# EAGLE design TuesdayR4 (EAGLE 7.7.0)
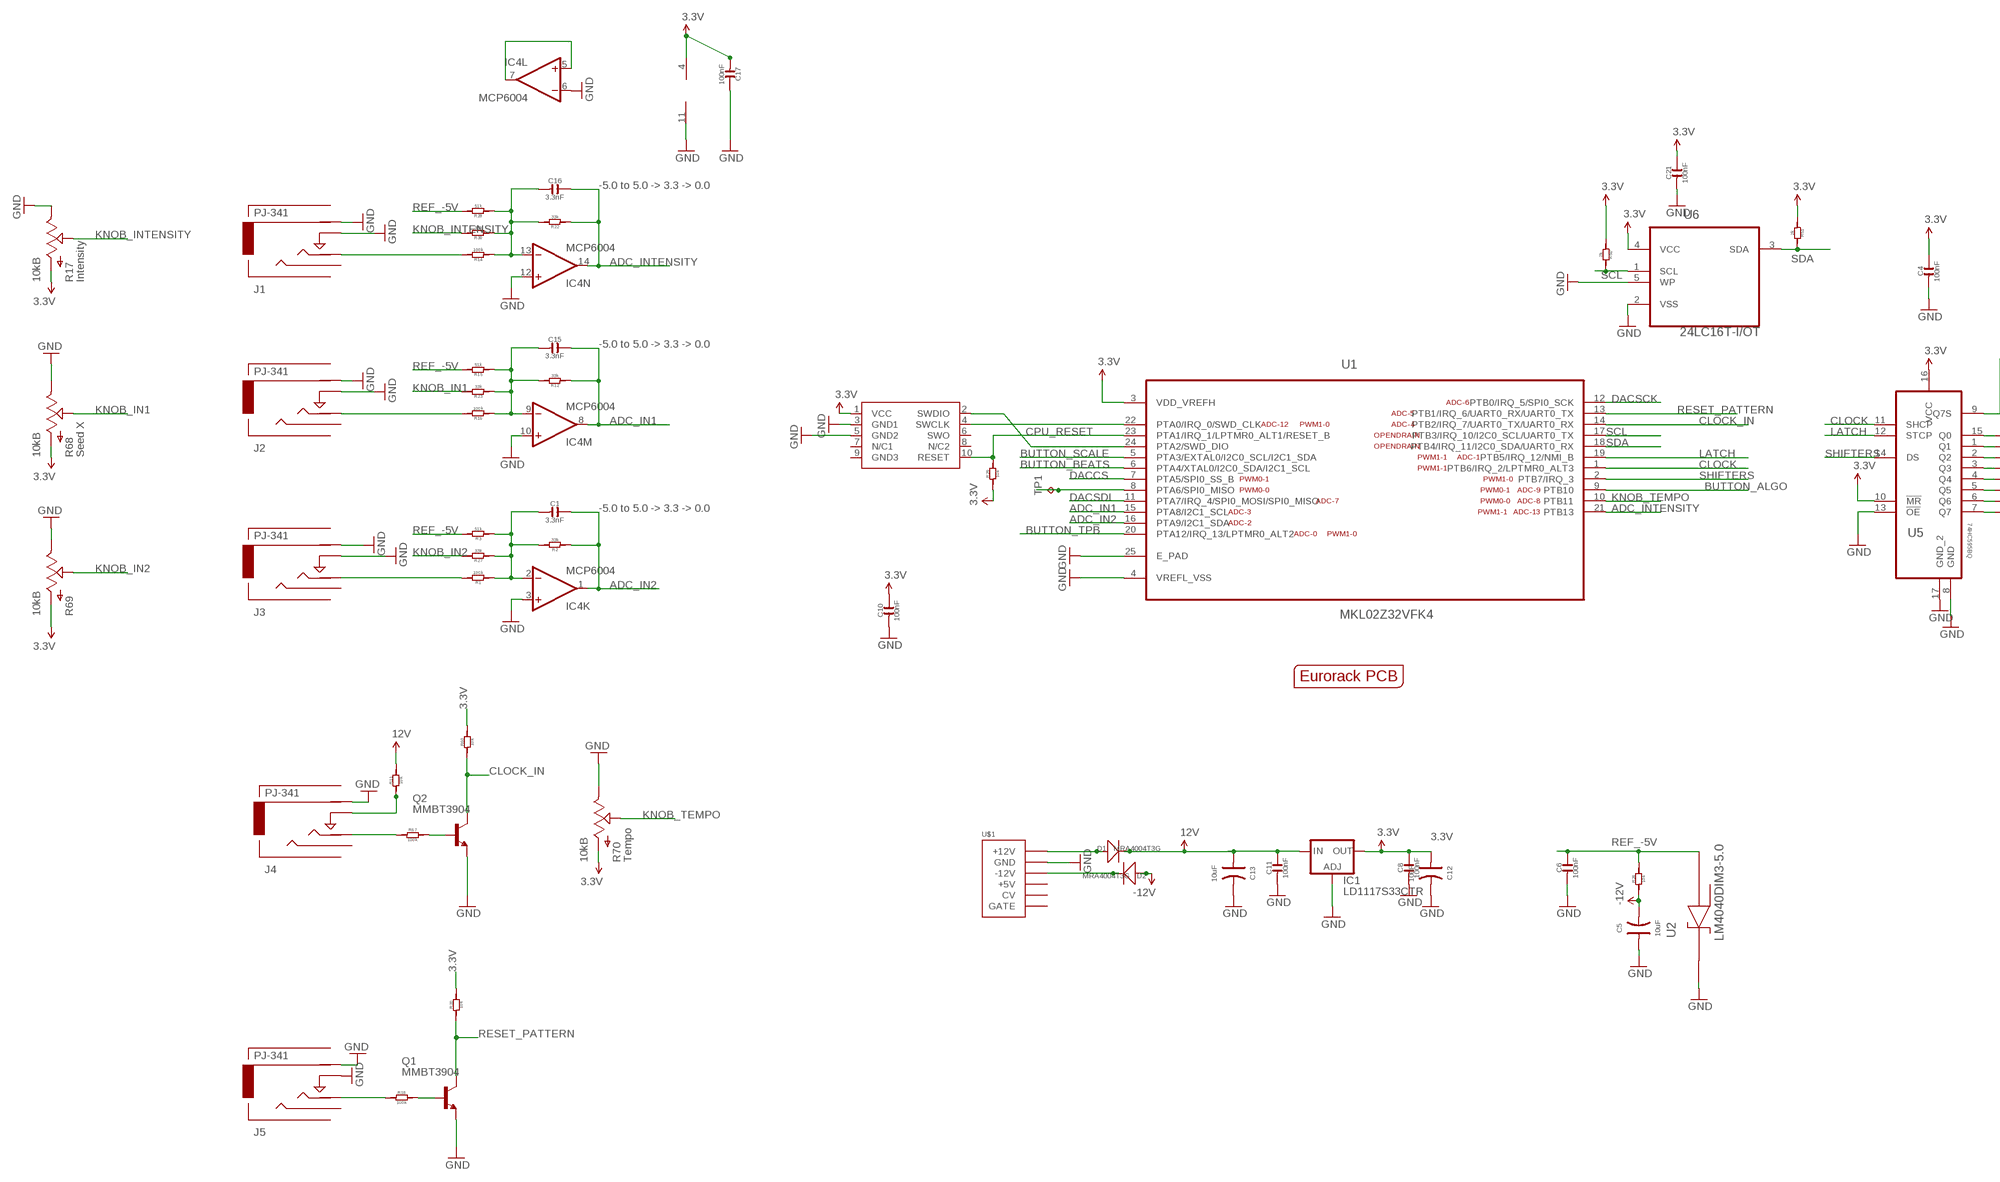
[diagram p0: schematic, sheet 1, part 1 of 2]
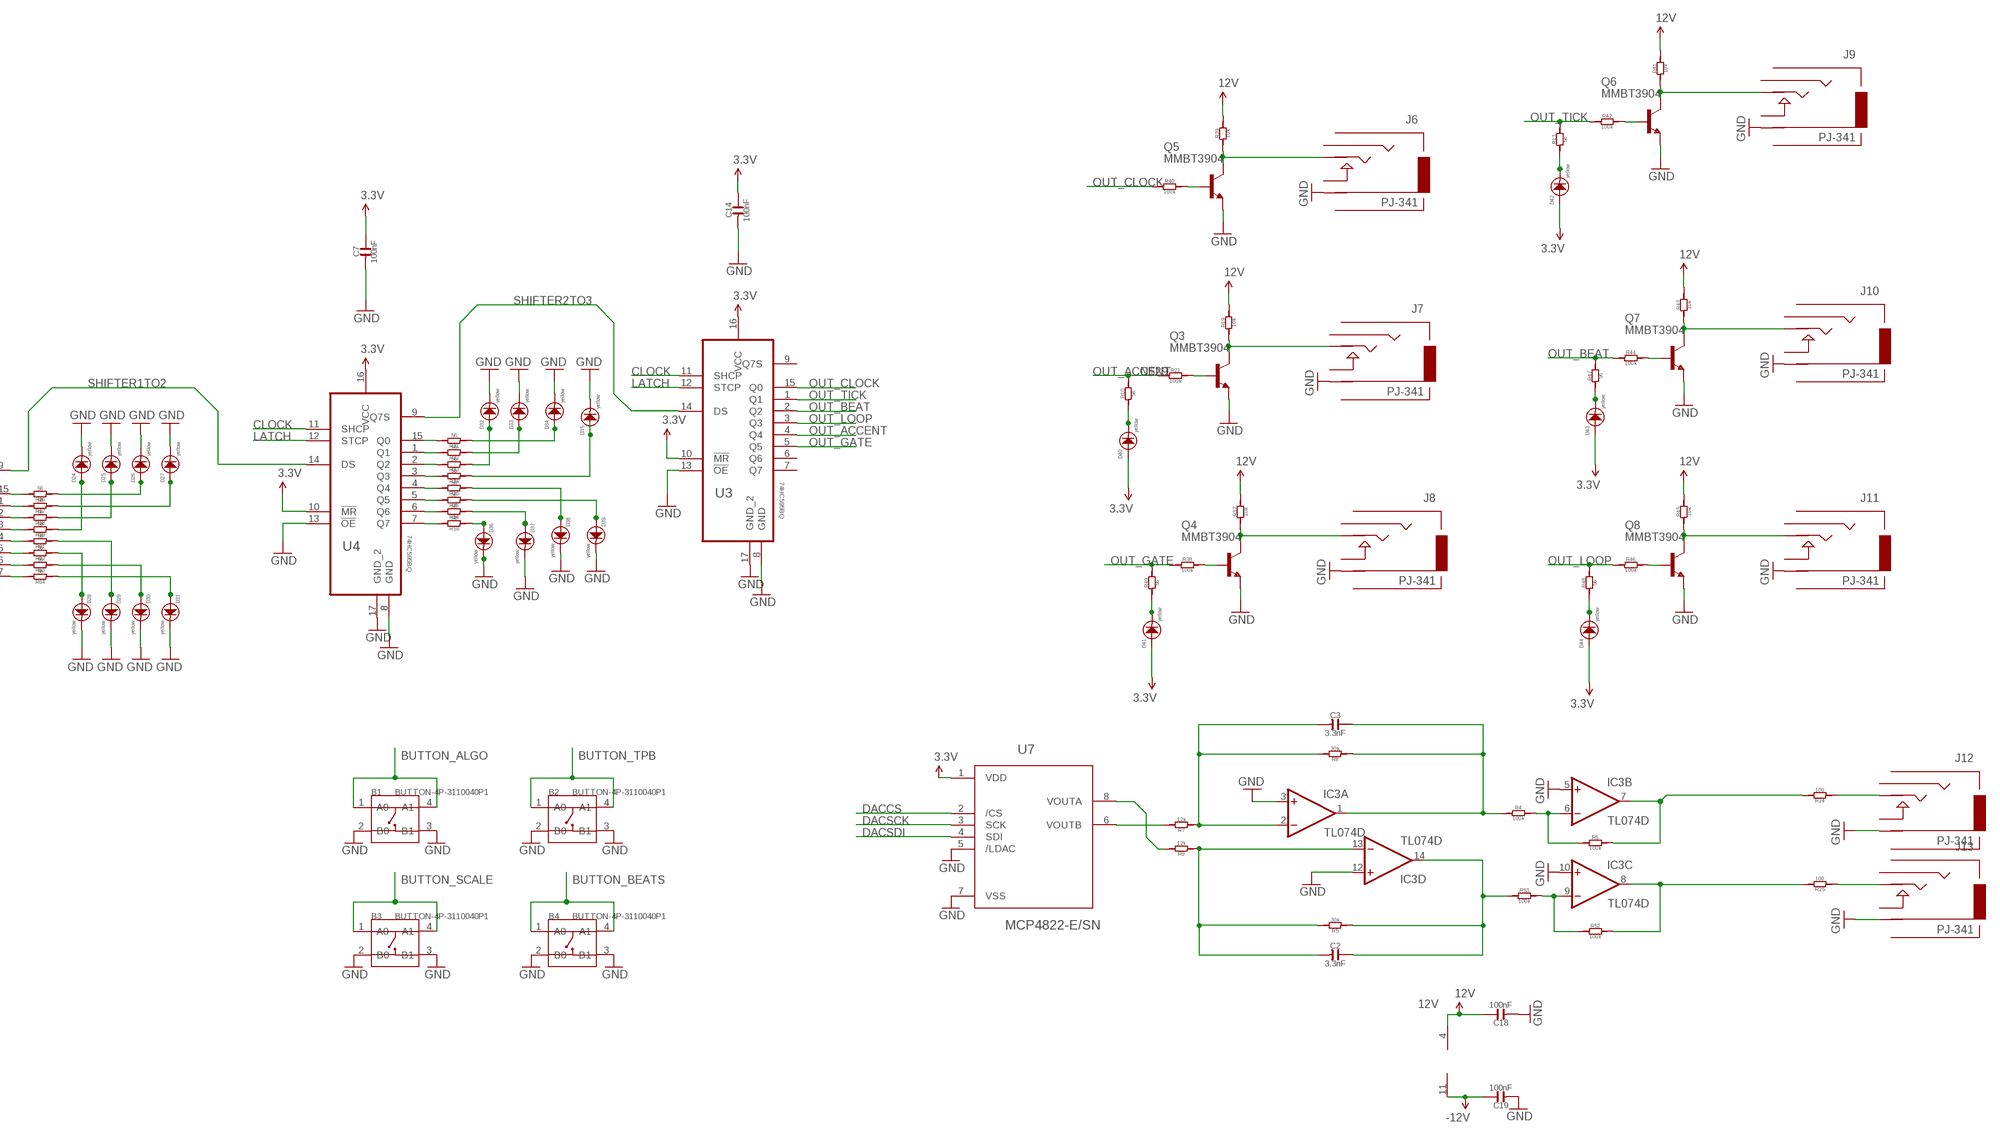
[diagram p1: schematic, sheet 1, part 2 of 2]

## Parts
B1  BUTTON-4P-3110040P1  [4P-6.0X6.0X5.0H]
B2  BUTTON-4P-3110040P1  [4P-6.0X6.0X5.0H]
B3  BUTTON-4P-3110040P1  [4P-6.0X6.0X5.0H]
B4  BUTTON-4P-3110040P1  [4P-6.0X6.0X5.0H]
C1  3.3nF  C-0603  [C0603]
C2  3.3nF  C-0603  [C0603]
C3  3.3nF  C-0603  [C0603]
C4  100nF  C-0603  [C0603]
C5  10uF  C-POLAR-A  [AVX-A]
C6  100nF  C-0603  [C0603]
C7  100nF  C-0603  [C0603]
C8  100nF  C-0603  [C0603]
C10  100nF  C-0603  [C0603]
C11  100nF  C-0603  [C0603]
C12  10uF  C-POLAR-A  [AVX-A]
C13  10uF  C-POLAR-A  [AVX-A]
C14  100nF  C-0603  [C0603]
C15  3.3nF  C-0603  [C0603]
C16  3.3nF  C-0603  [C0603]
C17  100nF  C-0603  [C0603]
C18  100nF  C-0603  [C0603]
C19  100nF  C-0603  [C0603]
C21  100nF  C-0603  [C0603]
D1  MRA4004T3G  D-SMA  [DO-214AC]
D2  MRA4004T3G  D-SMA  [DO-214AC]
D24  yellow  LED3MM  [3MMLED]
D25  yellow  LED3MM  [3MMLED]
D26  yellow  LED3MM  [3MMLED]
D27  yellow  LED3MM  [3MMLED]
D28  yellow  LED3MM  [3MMLED]
D29  yellow  LED3MM  [3MMLED]
D30  yellow  LED3MM  [3MMLED]
D31  yellow  LED3MM  [3MMLED]
D32  yellow  LED3MM  [3MMLED]
D33  yellow  LED3MM  [3MMLED]
D34  yellow  LED3MM  [3MMLED]
D35  yellow  LED3MM  [3MMLED]
D36  yellow  LED3MM  [3MMLED]
D37  yellow  LED3MM  [3MMLED]
D38  yellow  LED3MM  [3MMLED]
D39  yellow  LED3MM  [3MMLED]
D40  yellow  LED3MM  [3MMLED]
D41  yellow  LED3MM  [3MMLED]
D42  yellow  LED3MM  [3MMLED]
D43  yellow  LED3MM  [3MMLED]
D44  yellow  LED3MM  [3MMLED]
IC1  LD1117S33CTR  LD1117AS33TR  [SOT223]
IC3  TL074D  [SO14]
IC4  MCP6004  [SO14]
J1  PJ-341  AUDIO-JACKINPUT  [3.5MM-JACK-SWITCH-13MM-INPUT]
J2  PJ-341  AUDIO-JACKINPUT  [3.5MM-JACK-SWITCH-13MM-INPUT]
J3  PJ-341  AUDIO-JACKINPUT  [3.5MM-JACK-SWITCH-13MM-INPUT]
J4  PJ-341  AUDIO-JACKINPUT  [3.5MM-JACK-SWITCH-13MM-INPUT]
J5  PJ-341  AUDIO-JACKINPUT  [3.5MM-JACK-SWITCH-13MM-INPUT]
J6  PJ-341  AUDIO-JACKOUTPUT  [3.5MM-JACK-SWITCH-13MM-OUTPUT]
J7  PJ-341  AUDIO-JACKOUTPUT  [3.5MM-JACK-SWITCH-13MM-OUTPUT]
J8  PJ-341  AUDIO-JACKOUTPUT  [3.5MM-JACK-SWITCH-13MM-OUTPUT]
J9  PJ-341  AUDIO-JACKOUTPUT  [3.5MM-JACK-SWITCH-13MM-OUTPUT]
J10  PJ-341  AUDIO-JACKOUTPUT  [3.5MM-JACK-SWITCH-13MM-OUTPUT]
J11  PJ-341  AUDIO-JACKOUTPUT  [3.5MM-JACK-SWITCH-13MM-OUTPUT]
J12  PJ-341  AUDIO-JACKOUTPUT  [3.5MM-JACK-SWITCH-13MM-OUTPUT]
J13  PJ-341  AUDIO-JACKOUTPUT  [3.5MM-JACK-SWITCH-13MM-OUTPUT]
OUTLINE  EURORACK_PCB12HP  [EURORACK12HPPCB]
Q1  MMBT3904  MMBT3904LT1-NPN-SOT23-BEC  [SOT23-BEC]
Q2  MMBT3904  MMBT3904LT1-NPN-SOT23-BEC  [SOT23-BEC]
Q3  MMBT3904  MMBT3904LT1-NPN-SOT23-BEC  [SOT23-BEC]
Q4  MMBT3904  MMBT3904LT1-NPN-SOT23-BEC  [SOT23-BEC]
Q5  MMBT3904  MMBT3904LT1-NPN-SOT23-BEC  [SOT23-BEC]
Q6  MMBT3904  MMBT3904LT1-NPN-SOT23-BEC  [SOT23-BEC]
Q7  MMBT3904  MMBT3904LT1-NPN-SOT23-BEC  [SOT23-BEC]
Q8  MMBT3904  MMBT3904LT1-NPN-SOT23-BEC  [SOT23-BEC]
R1  100k  R-0603  [R0603]
R2  33k  R-0603  [R0603]
R3  51k  R-0603  [R0603]
R4  100k  R-0603  [R0603]
R5  30k  R-0603  [R0603]
R6  100k  R-0603  [R0603]
R7  12k  R-0603  [R0603]
R8  30k  R-0603  [R0603]
R9  12k  R-0603  [R0603]
R10  56  R-0603  [R0603]
R11  10k  R-0603  [R0603]
R12  33k  R-0603  [R0603]
R13  56  R-0603  [R0603]
R14  100k  R-0603  [R0603]
R15  51k  R-0603  [R0603]
R16  100k  R-0603  [R0603]
R17  10kB  POTZEPHPOT  [OG-POTS_ALPS_POT_VERTICAL]
R18  100k  R-0603  [R0603]
R19  10k  R-0603  [R0603]
R20  10k  R-0603  [R0603]
R21  100k  R-0603  [R0603]
R22  33k  R-0603  [R0603]
R23  33k  R-0603  [R0603]
R24  100  R-0603  [R0603]
R25  100  R-0603  [R0603]
R26  10k  R-0603  [R0603]
R27  33k  R-0603  [R0603]
R28  51k  R-0603  [R0603]
R29  10k  R-0603  [R0603]
R30  33k  R-0603  [R0603]
R31  56  R-0603  [R0603]
R32  56  R-0603  [R0603]
R33  56  R-0603  [R0603]
R34  56  R-0603  [R0603]
R35  56  R-0603  [R0603]
R36  56  R-0603  [R0603]
R37  10k  R-0603  [R0603]
R38  100k  R-0603  [R0603]
R39  10k  R-0603  [R0603]
R40  100k  R-0603  [R0603]
R41  10k  R-0603  [R0603]
R42  100k  R-0603  [R0603]
R43  10k  R-0603  [R0603]
R44  100k  R-0603  [R0603]
R45  10k  R-0603  [R0603]
R46  100k  R-0603  [R0603]
R47  56  R-0603  [R0603]
R48  56  R-0603  [R0603]
R49  56  R-0603  [R0603]
R50  2k  R-0603  [R0603]
R51  2k  R-0603  [R0603]
R52  100k  R-0603  [R0603]
R53  100k  R-0603  [R0603]
R54  56  R-0603  [R0603]
R55  56  R-0603  [R0603]
R56  56  R-0603  [R0603]
R57  56  R-0603  [R0603]
R58  56  R-0603  [R0603]
R59  56  R-0603  [R0603]
R60  10k  R-0603  [R0603]
R61  56  R-0603  [R0603]
R62  56  R-0603  [R0603]
R63  56  R-0603  [R0603]
R64  56  R-0603  [R0603]
R67  100k  R-0603  [R0603]
R68  10kB  POTZEPHPOT  [OG-POTS_ALPS_POT_VERTICAL]
R69  10kB  POTZEPHPOT  [OG-POTS_ALPS_POT_VERTICAL]
R70  10kB  POTZEPHPOT  [OG-POTS_ALPS_POT_VERTICAL]
SWD1  CORTEX_SWD  [M50-3600542]
TP1  TPB1,27  [B1,27]
U1  MKL02Z32VFK4  [QFN50P400X400X100-25N]
U2  LM4040DIM3-5.0  [SOT95P237X112-3N]
U3  74HC595BQ  [QFN50P250X350X100-17N]
U4  74HC595BQ  [QFN50P250X350X100-17N]
U5  74HC595BQ  [QFN50P250X350X100-17N]
U6  24LC16T-I/OT  24LC00T-I/OT  [SOT95P290X145-5N]
U7  MCP4822-E/SN  [SOIC8-N_MC]
U$1  POWERSMT  [2X08_SMT_HEADER]

## Nets
3.3V [mediumpower]: C4.2 C7.2 C8.2 C10.2 C12.+ C14.2 C17.1 C21.2 D40.+ D41.+ D42.+ D43.+ D44.+ IC1.2(OUT) IC1.4(OUT) IC4.4(O:V+) R17.P$3(A) R20.2 R29.1 R50.1 R51.1 R60.2 R68.P$3(A) R69.P$3(A) R70.P$3(A) SWD1.1(VCC) U1.3(VDD_VREFH) U3.10(!MR) U3.16(VCC) U4.10(!MR) U4.16(VCC) U5.10(!MR) U5.16(VCC) U6.4(VCC) U7.1(VDD)
12V [heavypower]: C11.2 C13.+ C18.2 D1.2(-) IC1.3(IN) IC3.4(P:V+) R11.2 R19.2 R37.2 R39.2 R41.2 R43.2 R45.2
-12V [heavypower]: C5.- C19.2 D2.1(+) IC3.11(P:V-) R26.1
ADC_IN1: C15.2 IC4.8(M:OUT) R12.1 U1.15(PTA8/I2C1_SCL)
ADC_IN2: C1.2 IC4.1(K:OUT) R2.1 U1.16(PTA9/I2C1_SDA)
ADC_INTENSITY: C16.2 IC4.14(N:OUT) R22.1 U1.21(PTB13)
BUTTON_ALGO: B1.1(A0) B1.4(A1) U1.9(PTB10)
BUTTON_BEATS: B4.1(A0) B4.4(A1) U1.6(PTA4/XTAL0/I2C0_SDA/I2C1_SCL)
BUTTON_SCALE: B3.1(A0) B3.4(A1) U1.5(PTA3/EXTAL0/I2C0_SCL/I2C1_SDA)
BUTTON_TPB: B2.1(A0) B2.4(A1) U1.20(PTA12/IRQ_13/LPTMR0_ALT2)
CLOCK: U1.1(PTB6/IRQ_2/LPTMR0_ALT3) U3.11(SHCP) U4.11(SHCP) U5.11(SHCP)
CLOCK_IN: Q2.C R60.1 U1.14(PTB2/IRQ_7/UART0_TX/UART0_RX)
CPU_RESET: R29.2 SWD1.10(RESET) U1.23(PTA1/IRQ_1/LPTMR0_ALT1/RESET_B)
D21: D43.- R47.1
DACCS: U1.7(PTA5/SPI0_SS_B) U7.2(/CS)
DACSCK: U1.12(PTB0/IRQ_5/SPI0_SCK) U7.3(SCK)
DACSDI: U1.11(PTA7/IRQ_4/SPI0_MOSI/SPI0_MISO) U7.4(SDI)
GND [groundplane]: B1.2(B0) B1.3(B1) B2.2(B0) B2.3(B1) B3.2(B0) B3.3(B1) B4.2(B0) B4.3(B1) C4.1 C5.+ C6.1 C7.1 C8.1 C10.1 C11.1 C12.- C13.- C14.1 C17.2 C18.1 C19.1 C21.1 D24.- D25.- D26.- D27.- D28.- D29.- D30.- D31.- D32.- D33.- D34.- D35.- D36.- D37.- D38.- D39.- IC1.1(ADJ) IC3.3(A:+IN) IC3.5(B:+IN) IC3.10(C:+IN) IC3.12(D:+IN) IC4.3(K:+IN) IC4.6(L:-IN) IC4.10(M:+IN) IC4.11(O:V-) IC4.12(N:+IN) J1.RING@3(RING) J1.SWITCH@3(SWITCH) J2.RING@3(RING) J2.SWITCH@3(SWITCH) J3.RING@3(RING) J3.SWITCH@3(SWITCH) J4.RING@3(RING) J5.RING@3(RING) J5.SWITCH@3(SWITCH) J6.RING@3(RING) J7.RING@3(RING) J8.RING@3(RING) J9.RING@3(RING) J10.RING@3(RING) J11.RING@3(RING) J12.RING@3(RING) J13.RING@3(RING) Q1.E Q2.E Q3.E Q4.E Q5.E Q6.E Q7.E Q8.E R17.P$1(E) R68.P$1(E) R69.P$1(E) R70.P$1(E) SWD1.3(GND1) SWD1.5(GND2) U1.4(VREFL_VSS) U1.25(E_PAD) U2.1(CATHODE) U3.8(GND) U3.13(!OE) U3.17(GND_2) U4.8(GND) U4.13(!OE) U4.17(GND_2) U5.8(GND) U5.13(!OE) U5.17(GND_2) U6.2(VSS) U6.5(WP) U7.5(/LDAC) U7.7(VSS) U$1.3(GND) U$1.4(GND) U$1.5(GND) U$1.6(GND) U$1.7(GND) U$1.8(GND)
KNOB_IN1: R23.2 R68.P$2(S)
KNOB_IN2: R27.2 R69.P$2(S)
KNOB_INTENSITY: R17.P$2(S) R30.2
KNOB_TEMPO: R70.P$2(S) U1.10(PTB11)
LATCH: U1.19(PTB5/IRQ_12/NMI_B) U3.12(STCP) U4.12(STCP) U5.12(STCP)
N$1: R32.2 U4.1(Q1)
N$2: IC3.6(B:-IN) R4.2 R6.1
N$3: J2.TIP@3(TIP) R16.2
N$4: C15.1 IC4.9(M:-IN) R12.2 R15.1 R16.1 R23.1
N$5: R9.2 U7.8(VOUTA)
N$6: J3.TIP@3(TIP) R1.2
N$7: R7.2 U7.6(VOUTB)
N$8: C1.1 IC4.2(K:-IN) R1.1 R2.2 R3.1 R27.1
N$9: C2.1 IC3.13(D:-IN) R5.2 R9.1
N$10: C3.1 IC3.2(A:-IN) R7.1 R8.2
N$12: D42.- R13.1
N$13 [heavypower]: D1.1(+) U$1.9(+12V) U$1.10(+12V)
N$14: IC3.7(B:OUT) R6.2 R24.2
N$15: Q1.B R18.2
N$16: J5.TIP@3(TIP) R18.1
N$17: IC3.9(C:-IN) R52.1 R53.2
N$18: C3.2 IC3.1(A:OUT) R4.1 R8.1
N$19: R33.2 U4.2(Q2)
N$20: J13.TIP@3(TIP) R25.1
N$21: J12.TIP@3(TIP) R24.1
N$23: D40.- R10.1
N$24: C2.2 IC3.14(D:OUT) R5.1 R53.1
N$25: Q3.B R21.2
N$26: R34.2 U4.3(Q3)
N$27: R35.2 U4.4(Q4)
N$28: D28.+ R62.1
N$29: J7.TIP@3(TIP) Q3.C R19.1
N$30: R36.2 U4.5(Q5)
N$31: R54.2 U4.6(Q6)
N$32: D29.+ R61.1
N$33: J1.TIP@3(TIP) R14.2
N$34: C16.1 IC4.13(N:-IN) R14.1 R22.2 R28.1 R30.1
N$35: R55.2 U4.7(Q7)
N$36: R31.2 U4.15(Q0)
N$37: R56.2 U5.15(Q0)
N$38: R57.2 U5.1(Q1)
N$39: R58.2 U5.2(Q2)
N$40: R59.2 U5.3(Q3)
N$41: R61.2 U5.4(Q4)
N$42: R62.2 U5.5(Q5)
N$43: J4.TIP@3(TIP) R67.1
N$44: D41.- R49.1
N$45: D44.- R48.1
N$48: R63.2 U5.6(Q6)
N$49: R64.2 U5.7(Q7)
N$57: Q4.B R38.2
N$58: J8.TIP@3(TIP) Q4.C R37.1
N$60: Q5.B R40.2
N$61: J6.TIP@3(TIP) Q5.C R39.1
N$63: Q6.B R42.2
N$64 [heavypower]: D2.2(-) U$1.1(-12V) U$1.2(-12V)
N$65: J9.TIP@3(TIP) Q6.C R41.1
N$66: Q2.B R67.2
N$68: Q7.B R44.2
N$69: J10.TIP@3(TIP) Q7.C R43.1
N$71: Q8.B R46.2
N$72: J11.TIP@3(TIP) Q8.C R45.1
N$73: D27.+ R57.1
N$74: D26.+ R56.1
N$75: D25.+ R58.1
N$76: D24.+ R59.1
N$77: D30.+ R63.1
N$78: D31.+ R64.1
N$79: D32.+ R33.1
N$80: D33.+ R32.1
N$81: D34.+ R31.1
N$82: D35.+ R34.1
N$83: D36.+ R55.1
N$84: D37.+ R54.1
N$85: D38.+ R35.1
N$86: D39.+ R36.1
N$94: IC3.8(C:OUT) R25.2 R52.2
N$96: J4.SWITCH@3(SWITCH) R11.1
N$97: IC4.5(L:+IN) IC4.7(L:OUT)
OUT_ACCENT: R10.2 R21.1 U3.4(Q4)
OUT_BEAT: R44.1 R47.2 U3.2(Q2)
OUT_CLOCK: R40.1 U3.15(Q0)
OUT_GATE: R38.1 R49.2 U3.5(Q5)
OUT_LOOP: R46.1 R48.2 U3.3(Q3)
OUT_TICK: R13.2 R42.1 U3.1(Q1)
PTA6: TP1.TP U1.8(PTA6/SPI0_MISO)
REF_-5V: C6.2 R3.2 R15.2 R26.2 R28.2 U2.2(ANODE)
RESET_PATTERN: Q1.C R20.1 U1.13(PTB1/IRQ_6/UART0_RX/UART0_TX)
SCL: R50.2 U1.17(PTB3/IRQ_10/I2C0_SCL/UART0_TX) U6.1(SCL)
SDA: R51.2 U1.18(PTB4/IRQ_11/I2C0_SDA/UART0_RX) U6.3(SDA)
SHIFTER1TO2: U4.14(DS) U5.9(Q7S)
SHIFTER2TO3: U3.14(DS) U4.9(Q7S)
SHIFTERS: U1.2(PTB7/IRQ_3) U5.14(DS)
SWD_CLK: SWD1.4(SWCLK) U1.22(PTA0/IRQ_0/SWD_CLK)
SWD_DIO: SWD1.2(SWDIO) U1.24(PTA2/SWD_DIO)
Unconnected: J1.SECOND@3(SECOND) J2.SECOND@3(SECOND) J3.SECOND@3(SECOND) J4.SECOND@3(SECOND) J5.SECOND@3(SECOND) J6.SECOND@3(SECOND) J6.SWITCH@3(SWITCH) J7.SECOND@3(SECOND) J7.SWITCH@3(SWITCH) J8.SECOND@3(SECOND) J8.SWITCH@3(SWITCH) J9.SECOND@3(SECOND) J9.SWITCH@3(SWITCH) J10.SECOND@3(SECOND) J10.SWITCH@3(SWITCH) J11.SECOND@3(SECOND) J11.SWITCH@3(SWITCH) J12.SECOND@3(SECOND) J12.SWITCH@3(SWITCH) J13.SECOND@3(SECOND) J13.SWITCH@3(SWITCH) SWD1.6(SWO) SWD1.7(N/C1) SWD1.8(N/C2) SWD1.9(GND3) U2.3(NC) U3.6(Q6) U3.7(Q7) U3.9(Q7S) U$1.11(+5V) U$1.12(+5V) U$1.13(CV) U$1.14(CV) U$1.15(GATE) U$1.16(GATE)

## Notes on the sheet
- -5.0 to 5.0 -> 3.3 -> 0.0
- -5.0 to 5.0 -> 3.3 -> 0.0
- -5.0 to 5.0 -> 3.3 -> 0.0

## Library data of the parts
B1-B4 = zephod-components:BUTTON-4P; OC_FARNELL: unknown
C1-C3 C15 C16 = OPL:C*; OC_FARNELL: unknown
C4 C7 C8 C10 C11 C14 C17-C19 C21 = OPL:C*; MF: MULTICOMP; MPN: MC0603F104Z160CT; OC_FARNELL: 1759017
C5 C12 C13 = OPL:C-POLAR*; MF: AVX; MPN: TAJB106K020RNJ; OC_FARNELL: 197427
C6 = OPL:C*; MF: AVX; MPN: 06035C104KAT2A; OC_FARNELL: 1301804
D1 D2 = OPL:D*: DIODE; MF: VISHAY; MPN: US1G-E3/5AT; OC_FARNELL: 9551824
D24-D44 = EurorackModularParts:LED*: LED
IC1 = ld-components:LD1117A?*: Low drop fixed and adjustable positive voltage regulators 1 A Source: http://www.st.com/stonline/products/literature/ds/7194/ld1117axx.pdf; MF: STMICROELECTRONICS; MPN: LD1117AS33TR; OC_FARNELL: 1467776
IC3 = EurorackModularParts:TL074: OP AMP; MF: TEXAS INSTRUMENTS; MPN: TL074CD; OC_FARNELL: 1103010
IC4 = EurorackModularParts:MCP6004; MF: MICROCHIP; MPN: MCP6004-I/SL.; OC_FARNELL: 1605572
J1 = EurorackModularParts:AUDIO-JACK: Switching Mono 3.5mm Audio Jack from Erthenvar.; DESC: Intensity; OC_FARNELL: unknown
J2 = EurorackModularParts:AUDIO-JACK: Switching Mono 3.5mm Audio Jack from Erthenvar.; DESC: Seed X; OC_FARNELL: unknown
J3 = EurorackModularParts:AUDIO-JACK: Switching Mono 3.5mm Audio Jack from Erthenvar.; DESC: Seed Y; OC_FARNELL: unknown
J4 = EurorackModularParts:AUDIO-JACK: Switching Mono 3.5mm Audio Jack from Erthenvar.; DESC: Clock; OC_FARNELL: unknown
J5 = EurorackModularParts:AUDIO-JACK: Switching Mono 3.5mm Audio Jack from Erthenvar.; DESC: Reset; OC_FARNELL: unknown
J6 = EurorackModularParts:AUDIO-JACK: Switching Mono 3.5mm Audio Jack from Erthenvar.; DESC: Clock Out; OC_FARNELL: unknown
J7 = EurorackModularParts:AUDIO-JACK: Switching Mono 3.5mm Audio Jack from Erthenvar.; DESC: Accent; OC_FARNELL: unknown
J8 = EurorackModularParts:AUDIO-JACK: Switching Mono 3.5mm Audio Jack from Erthenvar.; DESC: Gate; OC_FARNELL: unknown
J9 = EurorackModularParts:AUDIO-JACK: Switching Mono 3.5mm Audio Jack from Erthenvar.; DESC: Tick; OC_FARNELL: unknown
J10 = EurorackModularParts:AUDIO-JACK: Switching Mono 3.5mm Audio Jack from Erthenvar.; DESC: Beat; OC_FARNELL: unknown
J11 = EurorackModularParts:AUDIO-JACK: Switching Mono 3.5mm Audio Jack from Erthenvar.; DESC: Loop; OC_FARNELL: unknown
J12 = EurorackModularParts:AUDIO-JACK: Switching Mono 3.5mm Audio Jack from Erthenvar.; DESC: Note; OC_FARNELL: unknown
J13 = EurorackModularParts:AUDIO-JACK: Switching Mono 3.5mm Audio Jack from Erthenvar.; DESC: Velocity; OC_FARNELL: unknown
OUTLINE = EurorackModularParts:EURORACK_PCB; OC_FARNELL: unknown
Q1-Q8 = transistor:*-NPN-: NPN Transistror BF959 corrected 2008.03.06; MF: NXP; MPN: PMBT3904,215; OC_FARNELL: 2336795
R1-R16 R18-R64 R67 = OPL:R*; OC_FARNELL: unknown
R17 = EurorackModularParts:POT; DESC: Intensity; OC_FARNELL: unknown
R68 = EurorackModularParts:POT; DESC: Seed X; OC_FARNELL: unknown
R69 = EurorackModularParts:POT; DESC: Seed Y; OC_FARNELL: unknown
R70 = EurorackModularParts:POT; DESC: Tempo; OC_FARNELL: unknown
SWD1 = carrilib with jtags:CORTEX_SWD: .05" Cortex M Connector in SWD mode Manufacturer: Generic Part Number: Cortex M SWD Notes: I use Harwin M50-3600542 connectors; OC_FARNELL: unknown
TP1 = testpad:TP: Test pad; OC_FARNELL: unknown
U1 = FarnellThings:MKL02Z32VFK4: IC, MCU, 32BIT, CORTEX M0+, 48MHZ, QFN-24; MF: NXP; MPN: MKL02Z32VFK4; OC_FARNELL: 2321481; OC_NEWARK: 61W9887; PACKAGE: QFN-24; SUPPLIER: FREESCALE SEMICONDUCTOR
U2 = FarnellThings:LM4040DIM3-5.0: IC, Precision Micropower Shunt Voltage Reference, 5V,SOT-23-3; MF: TEXAS INSTRUMENTS; MPN: LM4040DIM3-5.0; OC_FARNELL: 9778330; OC_NEWARK: 97K3489; PACKAGE: SOT-23-3; SUPPLIER: TEXAS INSTRUMENTS
U3-U5 = FarnellThings:74HC595BQ: 8-bit serial-in, serial or parallel-out shift register,QFN-16; MF: NXP; MPN: 74HC595BQ; OC_FARNELL: 2164850; OC_NEWARK: 43W8000; PACKAGE: QFN-16; SUPPLIER: NXP
U6 = EurorackModularParts:24LC00T-I/OT: IC, EEPROM 128BIT SERIAL 400KHZ SOT-23-5; MF: MICROCHIP; MPN: 24LC00T-I/OT; OC_FARNELL: 9757864; OC_NEWARK: 62K0574; PACKAGE: SOT-23-5; SUPPLIER: MICROCHIP
U7 = FarnellThings:MCP4822-E/SN: 12 Bit DAC; DESCRIPTION: 12 Bit DAC; MF: MICROCHIP; MPN: MCP4822-E/SN; OC_FARNELL: 1439414; OC_NEWARK: 31K2975; PACKAGE: SOIC-8; SUPPLIER: Microchip
U$1 = EurorackModularParts:POWER

## Net classes
0 default: width 0.203 mm, clearance 0.178 mm
1 heavypower: width 0.381 mm
2 mediumpower: width 0.254 mm
3 groundplane: width 0.254 mm, clearance 0.203 mm

## Board
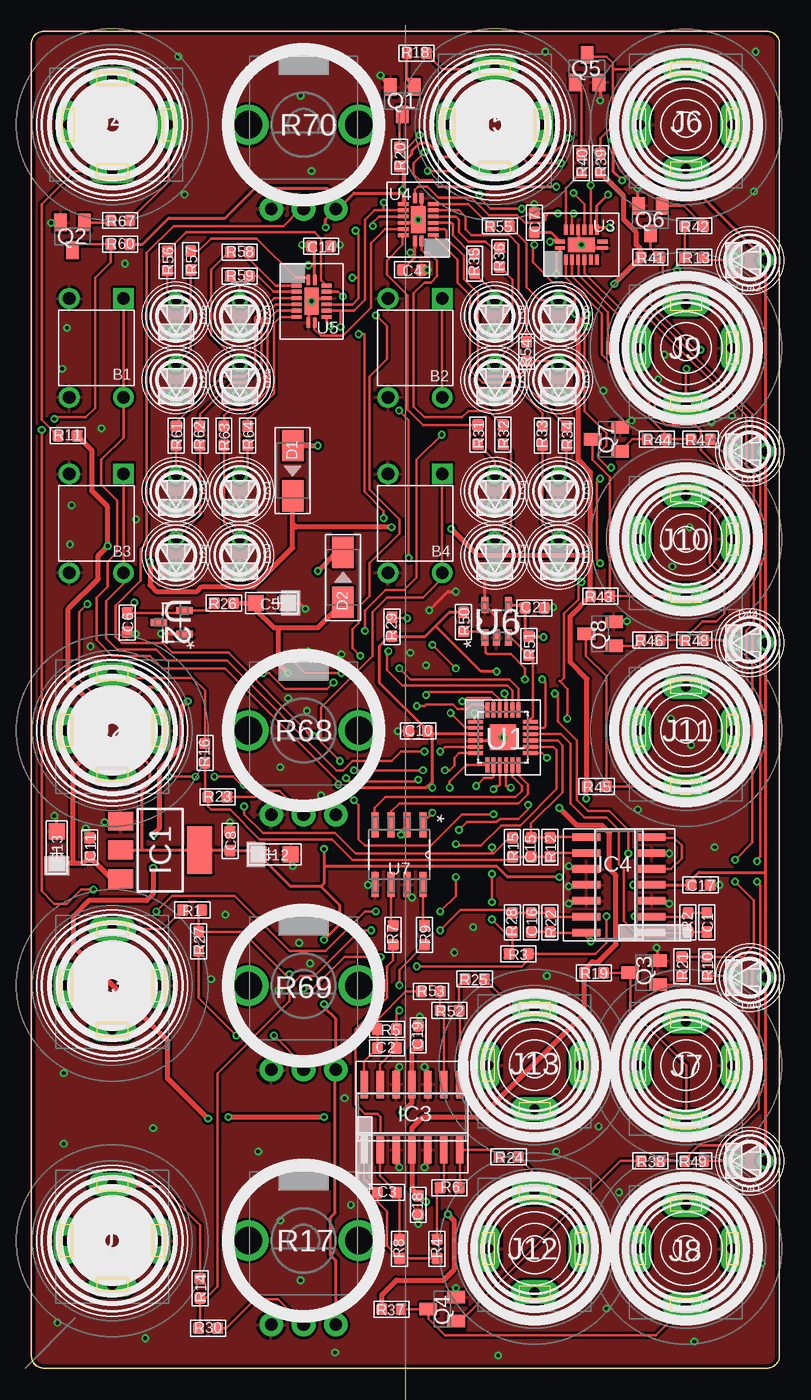
[diagram p2: board, top side]
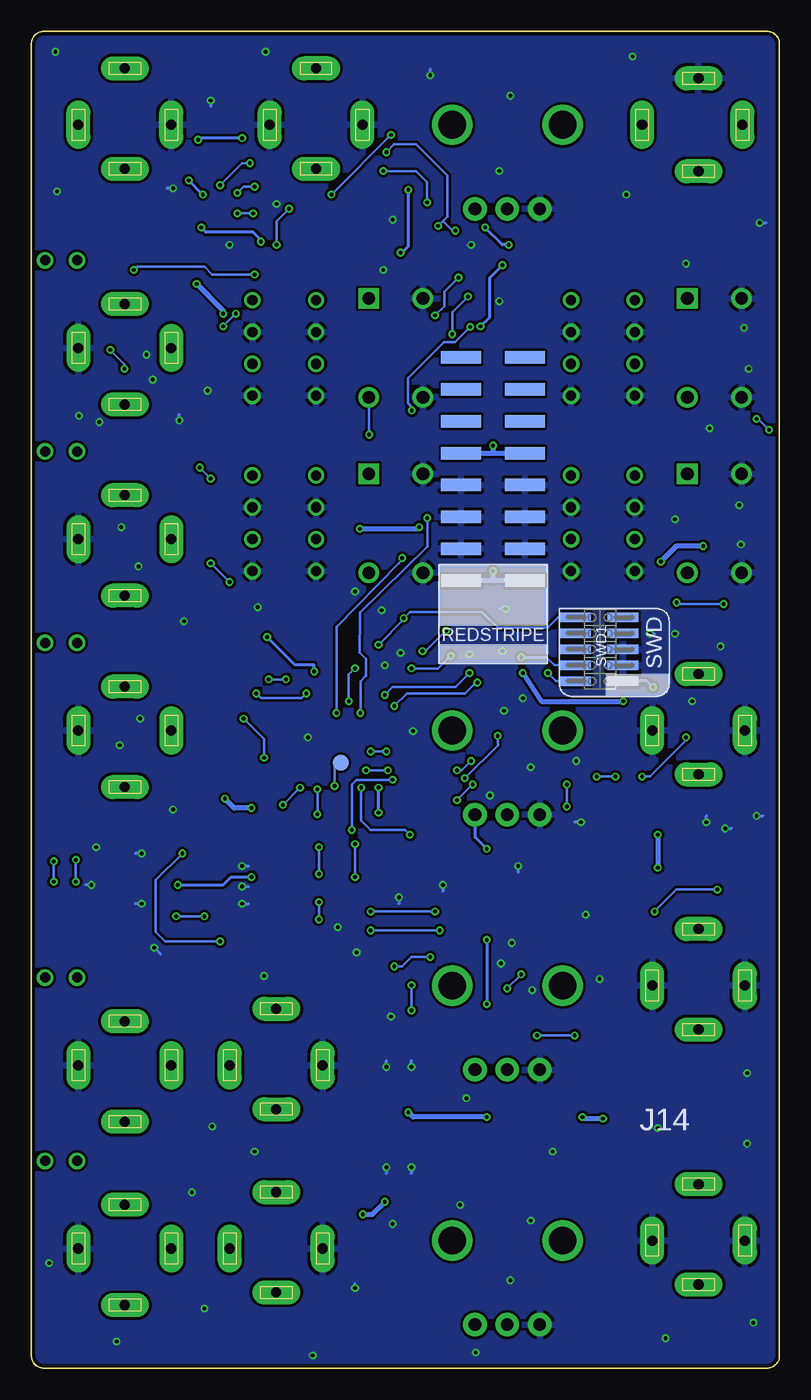
[diagram p3: board, bottom side, seen from below]

Size 59.62 x 106.5 mm. Coordinates in mm from the lower left corner, seen from the top.
Copper layers (1*16): Top 0.035mm / dielectric 1.5mm / Bottom 0.035mm
Design rules "dirt_cheap_dirty_boards.v1": minimum track width 5mil, minimum drill 12mil, track to track 5mil, track to pad 5mil, pad to pad 5mil, via to via 5mil, smd to smd 0mil, copper to edge 10mil, drill to drill 10mil, minimum pad ring 10mil, minimum via ring 6mil, stop-mask expansion 2mil, vias tented up to drill 25mil, thermal gap 10mil
tRestrict: area 36.2,51.3 to 39,51.7; area 38.6,48.9 to 39,51.6; area 36.3,48.8 to 39,49.2; area 36.1,50.2 to 36.5,51.6

### Footprints (pad centres in the part's own frame; a part is rotated, then mirrored left to right if it is on the bottom)
4P-6.0X6.0X5.0H = drill 1.016 pad 1.651 square: 1 -3.937,2.159 | drill 1.016 pad 1.651: 2 -3.937,-2.159; 3 3.937,-2.159; 4 3.937,2.159
C0603 = smd 0.889 x 0.889: 1 -0.762,0; 2 0.762,0
AVX-A = smd 1.27 x 1.27: + -1.27,0; - 1.27,0
DO-214AC = smd 2.5 x 1.7: 1 -2,0; 2 2,0
3MMLED = drill 0.8: + -1.27,0; - 1.27,0
SOT223 = smd 1.5 x 2: 1 -2.3,-3.15; 2 0,-3.15; 3 2.3,-3.15 | smd 3.8 x 2: 4 0,3.15
SO14 = smd 0.6 x 2.2: 1 -3.81,-2.6; 2 -2.54,-2.6; 3 -1.27,-2.6; 4 0,-2.6; 5 1.27,-2.6; 6 2.54,-2.6; 7 3.81,-2.6; 8 3.81,2.6; 9 2.54,2.6; 10 1.27,2.6; 11 0,2.6; 12 -1.27,2.6; 13 -2.54,2.6; 14 -3.81,2.6
3.5MM-JACK-SWITCH-13MM-INPUT = drill 0.8 pad 1.93 long: RING@3 -3.7,0; SECOND@3 0,-3.5; SWITCH@3 3.7,0; TIP@3 0,4.5
3.5MM-JACK-SWITCH-13MM-OUTPUT = drill 0.8 pad 1.93 long: RING@3 -3.7,0; SECOND@3 0,-3.5; SWITCH@3 3.7,0; TIP@3 0,4.5
SOT23-BEC = smd 1 x 1.4: B -0.95,-1.1; C 0,1.1; E 0.95,-1.1
R0603 = smd 0.889 x 0.889: 1 -0.762,0; 2 0.762,0
OG-POTS_ALPS_POT_VERTICAL = drill 1 pad 1.88: P$1 -2.58,-6.7; P$2 0,-6.7; P$3 2.58,-6.7 | drill 2.2 pad 3.175: P$4 4.4,0; P$5 -4.4,0
M50-3600542 = smd 0.75 x 2.5: 1 -2.54,-1.81; 2 -2.54,2; 3 -1.27,-1.81; 4 -1.27,2; 5 0,-1.81; 6 0,2; 7 1.27,-1.81; 8 1.27,2; 9 2.54,-1.81; 10 2.54,2
B1,27 = smd 1.27 x 1.27: TP 0,0
QFN50P400X400X100-25N = smd 1.2 x 0.3: 1 -2.2,1.245; 2 -2.2,0.762; 3 -2.2,0.254; 4 -2.2,-0.254; 5 -2.2,-0.762; 6 -2.2,-1.245; 13 2.2,-1.245; 14 2.2,-0.762; 15 2.2,-0.254; 16 2.2,0.254; 17 2.2,0.762; 18 2.2,1.245 | smd 0.3 x 1.2: 7 -1.245,-2.2; 8 -0.762,-2.2; 9 -0.254,-2.2; 10 0.254,-2.2; 11 0.762,-2.2; 12 1.245,-2.2; 19 1.245,2.2; 20 0.762,2.2; 21 0.254,2.2; 22 -0.254,2.2 | smd 0.305 x 1.2: 23 -0.762,2.2; 24 -1.245,2.2 | smd 2.032 x 2.032: 25 0,0
SOT95P237X112-3N = smd 1.321 x 0.559: 1 -1.016,0.94; 2 -1.016,-0.94; 3 1.016,0
QFN50P250X350X100-17N = smd 0.305 x 0.813: 1 -0.254,1.702; 8 -0.254,-1.702; 9 0.254,-1.702; 16 0.254,1.702 | smd 0.813 x 0.305: 2 -1.194,1.245; 3 -1.194,0.762; 4 -1.194,0.254; 5 -1.194,-0.254; 6 -1.194,-0.762; 7 -1.194,-1.245; 10 1.194,-1.245; 11 1.194,-0.762; 12 1.194,-0.254; 13 1.194,0.254; 14 1.194,0.762; 15 1.194,1.245 | smd 1.143 x 2.159: 17 0,0
SOT95P290X145-5N = smd 1.27 x 0.559: 1 -1.295,0.94; 2 -1.295,0; 3 -1.295,-0.94; 4 1.295,-0.94; 5 1.295,0.94
SOIC8-N_MC = smd 1.981 x 0.559: 1 -2.362,1.905; 2 -2.362,0.635; 3 -2.362,-0.635; 4 -2.362,-1.905; 5 2.362,-1.905; 6 2.362,-0.635; 7 2.362,0.635; 8 2.362,1.905
2X08_SMT_HEADER = smd 1 x 3.17: 1 -8.89,-2.54; 2 -8.89,2.54; 3 -6.35,-2.54; 4 -6.35,2.54; 5 -3.81,-2.54; 6 -3.81,2.54; 7 -1.27,-2.54; 8 -1.27,2.54; 9 1.27,-2.54; 10 1.27,2.54; 11 3.81,-2.54; 12 3.81,2.54; 13 6.35,-2.54; 14 6.35,2.54; 15 8.89,-2.54; 16 8.89,2.54

### Placement (x,y rotation side)
B1  5.18,81.28 270 top
B2  30.58,81.28 270 top
B3  5.18,67.31 270 top
B4  30.58,67.31 270 top
C1  53.83,35.5 270 top
C2  28.33,25.5 180 top
C3  28.33,14 180 top
C4  30.33,87.5 180 top
C5  19.15,60.96 180 top
C6  7.63,59.41 90 top
C7  40.08,91.25 270 top
C8  15.83,42 270 top
C10  30.83,50.75 0 top
C11  4.65,41.49 270 top
C12  19.39,40.93 0 top
C13  2.02,41.5 90 top
C14  23.08,89.38 180 top
C15  39.83,41.5 90 top
C16  39.83,35.5 270 top
C17  53.33,38.5 0 top
C18  30.83,13 90 top
C19  30.83,26.5 270 top
C21  40.1,60.58 180 top
D1  20.83,71.5 270 top
D2  24.83,63 90 top
D24  16.61,83.82 270 top
D25  16.61,78.74 270 top
D26  11.53,83.82 270 top
D27  11.53,78.74 270 top
D28  11.53,64.77 270 top
D29  11.53,69.85 270 top
D30  16.61,64.77 270 top
D31  16.61,69.85 270 top
D32  42.01,64.77 270 top
D33  36.93,64.77 270 top
D34  36.93,69.85 270 top
D35  42.01,69.85 270 top
D36  42.01,83.82 270 top
D37  42.01,78.74 270 top
D38  36.93,83.82 270 top
D39  36.93,78.74 270 top
D40  57.25,31.11 180 top
D41  57.25,16.51 180 top
D42  57.25,88.27 180 top
D43  57.25,73.03 180 top
D44  57.25,57.78 180 top
IC1  10.26,41.27 270 top
IC3  30.33,20 0 top
IC4  46.83,38.5 90 top
J1  6.45,10.16 0 top
J2  6.45,50.8 0 top
J3  6.45,30.48 0 top
J4  6.45,99.06 270 top
J5  36.93,99.06 0 top
J6  52.17,99.06 0 top
J7  52.17,24.13 180 top
J8  52.17,9.53 180 top
J9  52.17,81.28 180 top
J10  52.17,66.04 180 top
J11  52.17,50.8 180 top
J12  40.1,9.53 0 top
J13  40.1,24.13 0 top
OUTLINE  -0.5,0 0 top
Q1  29.56,100.97 180 top
Q2  3.28,90.17 180 top
Q3  48.83,31.5 90 top
Q4  32.74,4.7 90 top
Q5  44.27,103.53 0 top
Q6  49.33,91.5 180 top
Q7  45.83,74 90 top
Q8  45.33,58.5 90 top
R1  12.83,36.5 180 top
R2  52.33,35.5 90 top
R3  38.83,33 180 top
R4  32.33,9.5 90 top
R5  28.33,27 0 top
R6  33.33,14.38 0 top
R7  28.83,34.5 90 top
R8  29.33,9.5 90 top
R9  31.33,34.5 90 top
R10  53.83,32 90 top
R11  2.88,74.29 0 top
R12  41.33,41.5 270 top
R13  52.83,88.5 180 top
R14  13.44,6.35 90 top
R15  38.33,41.5 90 top
R16  13.83,49 90 top
R17  21.69,10.16 0 top
R18  30.7,104.78 180 top
R19  44.83,31.5 180 top
R20  29.33,96.5 270 top
R21  51.83,32 270 top
R22  41.33,35.5 90 top
R23  14.83,45.5 0 top
R24  38.03,16.83 180 top
R25  35.33,31 180 top
R26  15.34,60.96 180 top
R27  13.33,34 270 top
R28  38.33,35.5 270 top
R29  28.74,59.06 90 top
R30  14.07,3.17 0 top
R31  35.58,74.38 90 top
R32  37.58,74.38 90 top
R33  40.74,74.3 90 top
R34  42.64,74.3 90 top
R35  35.33,88 90 top
R36  37.33,88.5 90 top
R37  28.7,4.7 180 top
R38  49.33,16.5 180 top
R39  45.33,96 270 top
R40  43.83,96 90 top
R41  49.33,88.5 180 top
R42  52.83,91 0 top
R43  45.33,61.5 180 top
R44  49.83,74 180 top
R45  45.05,46.35 180 top
R46  49.33,58 180 top
R47  53.33,74 180 top
R48  52.83,58 180 top
R49  52.83,16.5 180 top
R50  34.43,59.45 270 top
R51  39.64,57.55 270 top
R52  33.33,28.5 0 top
R53  31.83,30 0 top
R54  39.47,80.99 90 top
R55  37.33,91 180 top
R56  10.84,88.2 90 top
R57  12.71,88.25 90 top
R58  16.61,88.9 0 top
R59  16.61,87 0 top
R60  7.09,89.53 0 top
R61  11.53,74.3 90 top
R62  13.44,74.3 90 top
R63  15.34,74.3 90 top
R64  17.24,74.3 90 top
R67  7.09,91.44 180 top
R68  21.69,50.8 0 top
R69  21.69,30.48 0 top
R70  21.69,99.06 0 top
SWD1  14.3,57.26 90 bottom
TP1  34.95,48.25 0 bottom
U1  37.58,50.25 0 top
U2  11.17,59.41 180 top
U3  43.83,89.5 90 top
U4  30.83,91.5 180 top
U5  22.33,85 0 top
U6  37.08,59.5 90 top
U7  29.31,40.91 270 top
U$1  22.83,71.63 90 bottom

### Tracks (layer width: path | path; a pad name or v marks a point on that pad's centre or on a via)
3.3V  (via drill 0.3)
  Top 0.254: U1.3 31.84,50.5 arc-90 C10.2 | IC1.2 8.92,41.27 | 8.92,41.27 IC1.4 15.79,41.27 C8.2 17.81,41.24 C12.+ 20.67,38.38 23.08,38.38 | C4.2 30.58,88.51 U4.16 30.58,89.25 v30.2,88.88 | U5.16 22.58,87.75 | 22.58,87.75 22.58,87.88 | 22.58,87.88 22.58,88.93 C14.2 21.7,89.38 v21.58,89.5 | R17.P$3 24.27,8.56 23.83,9 23.83,12 24.2,12.38 24.2,23.71 R69.P$3 24.27,27.81 23.33,28.75 v23.33,29 | D41.+ D40.+ 58.52,39.5 | 58.52,39.5 D44.+ D43.+ D42.+ 52.78,94 49.83,94 48.83,95 47.45,95 v47.08,94.62 46.33,95.38 v46.33,97.88 | 58.52,39.5 53.2,39.5 52.57,38.86 C17.1 IC4.4 v47.95,38.5 | U6.4 39.12,60.8 C21.2 39.34,58.61 R51.1 39.7,58.25 v40.83,58.25 | 32.2,59.12 31.38,58.3 R29.1 28.51,58.3 27.7,57.5 27.7,54.64 C10.2 | 32.2,59.12 33.33,60.25 34.4,60.25 R50.1 | 23.08,38.38 24.58,36.88 24.58,35.38 v23.33,34.12 | v23.33,41.38 23.33,40 | 23.33,40 23.33,38.62 23.08,38.38 | U7.1 31.21,43.51 v31.95,44.25 | v31.95,46.25 31.95,46.75 | 31.95,46.75 31.95,50.39 C10.2 | R68.P$3 24.27,44.94 25.58,46.25 31.45,46.25 31.95,46.75 | 23.33,40 37.08,40 37.95,39.12 v42.08,39.12 | C7.2 41.39,90.49 42.03,89.86 | 42.03,89.86 U3.16 | v45.95,93.5 45.07,92.62 U3.10 45.26,90.88 v46.08,90.88 | v37.08,55.5 35.83,55.5 32.2,59.12 | U4.10 29.64,93.75 | 29.64,93.75 29.64,94.38 | 29.64,94.38 29.64,95.43 R20.2 29.57,95.74 R20.2 30.33,96.75 30.33,97 30.95,97.62 31.58,97.62 32.7,96.5 33.7,96.5 35.08,97.88 38.58,97.88 39.83,96.62 41.45,96.62 v42.83,98 | 24.83,92.75 24.66,92.75 R70.P$3 23.45,91.55 v23.45,90.88 | R60.2 8.87,89.53 10.96,91.62 15.46,91.62 17.83,94 23.58,94 24.83,92.75 | 23.52,83.43 U5.10 23.52,83.31 v23.83,83 | 22.58,87.75 22.46,87.88 v22.08,87.88 22.58,87.88
  Top 0.254: 42.03,89.86 41.44,89.86 v41.33,89.75 | 24.83,92.75 25.7,93.62 29.51,93.62 29.64,93.75 | v29.58,93.88 29.64,94.38 | 8.92,41.27 8.83,41.36 8.83,46 9.46,46.62 9.46,48 8.46,49 8.46,53.62 9.08,54.25 v10.08,54.25
  Bottom 0.254: v40.83,58.25 38.61,56.03 37.12,56.03 37.12,55.54 v37.08,55.5 | R68.P$3 24.27,42.31 v23.33,41.38 | v31.95,44.25 v31.95,46.25 | v47.95,38.5 44.33,38.5 43.7,39.12 v42.08,39.12 | v45.95,93.5 v47.08,94.62 | v21.58,89.5 22.08,89.5 v23.45,90.88 | v23.83,83 23.08,83.75 23.08,86.88 v22.08,87.88 | v41.33,89.75 41.33,89.88 41.95,90.5 45.7,90.5 v46.08,90.88 | v30.2,88.88 30.08,88.88 29.58,89.38 v29.58,93.88 | v42.83,98 46.2,98 v46.33,97.88 | v23.33,34.12 v23.33,29 | v10.08,54.25 10.55,54.72 SWD1.1
12V  (via drill 0.3)
  Top 0.381: C13.+ 3.35,40.23 | 3.35,40.23 4.15,40.23 C11.2 6.4,38.98 IC1.3 | 3.35,40.23 3.35,47.77 4.83,49.25 4.83,52.88 2.96,54.75 2.96,60.5 5.33,62.88 5.33,64.75 v6.08,65.5 6.08,68.62 4.83,69.88 4.83,73.1 R11.2 | v9.46,64.25 9.46,62.38 9.96,61.88 13.21,61.88 13.58,62.25 17.7,62.25 20.83,65.38 20.83,67.25 | 20.83,67.25 D1.2 | 44.57,64.74 R43.2 42.95,59.89 42.95,56.25 44.29,54.92 R45.2 44.2,46.27 v44.2,45.38 | 44.57,64.74 44.57,71.39 43.58,72.38 43.58,83.25 v44.33,84 | v46.45,86.39 R41.2 48.57,89.14 48.2,89.5 48.2,90.5 47.2,91.5 47.2,93.36 R39.2 | R37.2 27.94,5.86 29.08,7 32.83,7 33.7,7.88 33.7,11.75 v33.2,12.25 | v31.45,13.25 31.34,13.25 C18.2 30.33,14.26 IC3.4 30.33,19.12 31.2,20 35.83,20 44.08,28.25 44.08,31.49 R19.2 44.07,31.74 44.7,32.38 45.2,32.38 46.58,33.75 46.58,39.25 46.08,39.75 46.08,42.62 45.45,43.25 43.45,43.25 v42.08,44.62 | 44.57,64.74 35.59,64.74 v33.45,66.88 | v28.7,67 21.08,67 20.83,67.25
  Bottom 0.381: v6.08,65.5 8.21,65.5 v9.46,64.25 | v33.2,12.25 32.45,12.25 v31.45,13.25 | v42.08,44.62 43.45,44.62 v44.2,45.38 | v44.33,84 44.33,84.26 v46.45,86.39 | v33.45,66.88 28.83,66.88 v28.7,67
-12V  (via drill 0.3)
  Top 0.381: C19.2 30.33,25.24 IC3.11 30.33,21.12 v29.58,20.38 | R26.1 C5.- 17.88,60.45 19.33,59 19.7,59 | 19.7,59 22.83,59 D2.1 | v12.46,53.12 11.96,52.62 11.96,49.5 10.21,47.75 10.21,43 v9.71,42.5 | v9.71,39.88 9.71,37.75 9.21,37.25 4.58,37.25 3.33,36 3.33,33.62 10.83,26.12 10.83,23.12 v14.08,19.88 | v15.71,20 v23.33,20 | v20.45,55.38 19.7,56.12 19.7,59
  Bottom 0.381: v20.45,55.38 18.95,53.12 v12.46,53.12 | v9.71,42.5 v9.71,39.88 | v14.08,19.88 15.58,19.88 v15.71,20 | v23.33,20 29.2,20 v29.58,20.38
ADC_IN1
  Top 0.203: IC4.8 41.38,42.31 R12.1 C15.2 39.83,43.38 42.33,45.88 42.33,49.62 41.95,50 U1.15
ADC_IN2
  Top 0.203: C1.2 R2.1 52.28,34.69 IC4.1 48.14,34.69 47.2,35.62 47.2,39.75 46.83,40.12 46.83,42.88 45.83,43.88 44.08,43.88 42.95,45 42.95,49.75 42.2,50.5 U1.16
ADC_INTENSITY  (via drill 0.3)
  Top 0.203: C16.2 R22.1 41.38,34.69 IC4.14 44.23,34.35 v44.58,34 | U1.21 37.83,53.62 v37.7,53.75 | v41.7,53.75 41.95,53.75 41.95,51.5 43.45,50 43.45,45.25 44.33,44.38 46.08,44.38 47.58,42.88 v47.58,41
  Bottom 0.203: v37.7,53.75 38.08,53.38 41.33,53.38 v41.7,53.75 | v44.58,34 48.95,34 49.7,34.75 49.7,38.88 v47.58,41
BUTTON_ALGO  (via drill 0.3)
  Top 0.203: B1.1 B1.4 7.34,74.13 5.58,72.38 5.58,70.38 6.83,69.12 6.83,65 6.08,64.25 6.08,62.25 5.21,61.38 5.21,58 6.46,56.75 9.46,56.75 10.46,55.75 15.46,55.75 24.45,46.75 v24.45,46.5 | U1.9 37.33,46.5 37.2,46.38 37.08,46.38 v36.83,46.12 | v36.83,44.12 34.33,44.12 31.83,41.62 26.58,41.62 26.08,42.12 26.08,44.88 v25.7,45.25
  Bottom 0.203: v36.83,46.12 v36.83,44.12 | v25.7,45.25 v24.45,46.5
BUTTON_BEATS  (via drill 0.3)
  Top 0.203: B4.1 B4.4 32.74,62.91 31.2,61.38 28.33,61.38 27.2,60.25 27.2,56.75 23.08,52.62 23.08,49.88 v24.58,48.38 | v32.95,47.62 33.33,47.62 33.7,48 33.7,48.62 34.08,49 U1.6 | v31.2,47.62 v25.7,47.62
  Bottom 0.203: v31.2,47.62 v32.95,47.62 | v25.7,47.62 25.33,47.62 v24.58,48.38
BUTTON_SCALE  (via drill 0.3)
  Top 0.203: B3.1 B3.4 7.34,62.51 5.96,61.12 5.96,58.12 6.83,57.25 9.96,57.25 10.83,56.38 15.58,56.38 24.33,47.62 24.83,47.62 25.58,48.38 28.7,48.38 29.45,49.12 v31.33,49.12 | U1.5 32.94,49.49 v32.58,49.12
  Bottom 0.203: v32.58,49.12 v31.33,49.12
BUTTON_TPB  (via drill 0.3)
  Top 0.203: B2.4 B2.1 | U1.20 38.34,53.99 37.95,54.38 29.58,54.38 28.33,55.62 28.33,57.12 v28.45,57.12 | v26.58,58.75 26.58,60.38 28.2,62 29.7,62 30.7,63 30.7,72.38 v32.7,74.38
  Bottom 0.203: v28.45,57.12 28.2,57.12 v26.58,58.75 | v32.7,74.38 32.7,77.31 B2.4
CLOCK  (via drill 0.3)
  Top 0.203: U4.11 28.08,92.26 | 28.08,92.26 27.34,92.26 26.58,91.5 26.58,85.12 25.7,84.25 24.64,84.25 | 24.64,84.25 23.54,84.25 U5.11 | U3.11 44.59,93.86 v44.58,94.25 | v42.2,96 39.58,96 38.45,97.12 35.33,97.12 33.58,95.38 v31.58,95.38 | v28.08,92.88 28.08,92.26 | v35.31,52.2 35.31,51.53 U1.1 | v30.07,64.54 30.07,75.53 v29.31,76.3 | 24.64,84.25 v24.64,82.96
  Bottom 0.203: v44.58,94.25 42.83,96 v42.2,96 | v31.58,95.38 28.95,95.38 28.08,94.5 v28.08,92.88 | v35.31,52.2 35.31,59.05 30.33,64.12 30.07,64.38 v30.07,64.54 | v29.31,76.3 29.31,76.58 29.6,76.87 29.6,78.87 26.74,81.72 25.88,81.72 v24.64,82.96
CLOCK_IN  (via drill 0.3)
  Top 0.203: Q2.C 3.74,89.53 R60.1 6.32,88.12 5.08,86.88 5.08,76.5 4.33,75.75 1.96,75.75 v1.83,75.62 | U1.14 41.59,49.49 41.83,49.25 41.83,46.12 38.95,43.25 37.45,43.25 35.83,41.62 33.95,41.62 v33.83,41.75 | v33.83,39.12 33.83,37.62 v32.58,36.38 | 26.7,36.38 v27.45,36.38 26.58,36.38 23.45,33.25 20.58,33.25 16.2,37.62 11.21,37.62 v9.96,36.38 | v0.83,74.75 0.83,38 1.83,37 2.83,37 3.96,38.12 v4.96,38.12
  Bottom 0.203: v33.83,41.75 v33.83,39.12 | v32.58,36.38 v27.45,36.38 | v1.83,75.62 1.71,75.62 v0.83,74.75 | v4.96,38.12 8.21,38.12 v9.96,36.38
CPU_RESET  (via drill 0.3)
  Top 0.203: v29.95,59.75 28.82,59.75 R29.2 | U1.23 36.82,53.14 36.58,53.38 34.7,53.38 34.45,53.12 v34.33,53.12 | v31.95,57.62 v33.83,55.75
  Bottom 0.203: 30.05,59.84 v29.95,59.75 | v29.95,59.75 29.45,60.25 23.7,60.25 22.45,59 18.45,59 17.65,59.8 SWD1.10 | v29.95,59.75 29.95,59.62 v31.95,57.62 | v33.83,55.75 34.33,55.25 v34.33,53.12
D21
  Top 0.203: R47.1 55.07,73.03 D43.-
DACCS  (via drill 0.3)
  Top 0.203: U1.7 34.95,48.05 34.62,48.05 33.33,46.75 v33.33,46.25 | v29.45,42.5 29.45,42.78 U7.2
  Bottom 0.203: v33.33,46.25 33.33,43.62 32.58,42.88 29.83,42.88 v29.45,42.5
DACSCK
  Top 0.203: U7.3 28.67,44.34 29.33,45 38.83,45 39.58,45.75 39.58,46.5 38.83,47.25 U1.12
DACSDI
  Top 0.203: U7.4 27.33,43.35 27.33,44.62 28.2,45.5 38.58,45.5 39.08,46 39.08,46.38 38.33,47.12 38.33,48.04 U1.11
GND  (via drill 0.3)
  Top 0.254: Q2.E 2.31,91.25 v1.58,91.25 | 30.99,87.5 C4.1 v31.58,87.5 | C14.1 24.08,89.5 v24.58,89.5 | U1.4 37.33,50 arc90 U1.25 | IC3.12 29.06,23.73 v29.33,24 | IC3.10 31.6,23.73 v31.33,24 | IC3.5 31.6,16.27 v31.33,16 | IC3.3 29.06,16.27 v29.33,16 | IC4.12 43.06,37.23 v42.83,37 | IC4.11 v42.83,38.38 | IC4.10 43.06,39.77 v42.83,40 | IC4.3 50.6,37.23 v50.83,37 | C17.2 v54.83,38.5 | IC4.6 50.79,41.04 v50.83,41 | Q3.E 49.93,33.4 v49.83,33.5 | C13.- 2.02,43.81 v1.83,44 | C11.1 4.65,42.69 v4.33,43 | IC1.1 5.91,43.58 v5.83,43.5 | C8.1 v15.83,43.5 | C12.- 20.66,40.17 v20.83,40 | U7.5 26.88,38.55 v26.83,38.5 | U7.7 29.95,37.88 v30.33,37.5 | C6.1 8.23,58.65 v8.33,58.5 | C5.+ 21.37,60.96 v21.83,60.5 | Q7.E 47.48,75.5 v47.83,75.5 | Q6.E 48.33,92.65 v48.33,94 | Q5.E 45.33,102.33 v45.33,101 | Q1.E 27.83,102.84 v27.83,103 | U5.8 22.08,84.75 U5.17 22.58,85.25 U5.13 | Q4.E 33.84,6.37 v33.83,6.38 | C19.1 30.83,27.88 v30.95,28 | C18.1 v30.83,11.5 | C10.1 v29.2,50.75 | C21.1 41.53,60.58 v41.58,60.62 | Q8.E 47.41,59.45 v47.45,59.5 | D33.- 36.14,62.71 U6.5 37.08,59.86 U6.2 | U4.13 30.58,91.25 U4.17 31.08,91.75 U4.8 | U3.8 44.08,89.25 U3.17 43.58,89.75 U3.13 | C7.1 v40.08,92.75 | v31.7,60.38 33.2,61.88 v33.83,61.88 | U2.1 12.15,58.5 v10.33,58.5
  Bottom 0.254: v1.58,91.25 1.08,91.25 | v31.58,87.5 31.83,87.5 | v24.58,89.5 24.83,89.5 | v29.33,24 29.33,24.5 | v31.33,24 31.33,24.5 | v31.33,16 31.33,15.5 | v29.33,16 29.33,15.5 | v42.83,37 42.33,37 | v42.83,38.38 42.33,38.38 | v42.83,40 42.33,40 | v50.83,37 51.33,37 | v54.83,38.5 55.33,38.5 | v50.83,41 51.33,41 | v49.83,33.5 49.33,33 | v1.83,44 1.33,44 | v4.33,43 3.83,43 | v5.83,43.5 5.83,44 | v15.83,43.5 16.33,43.5 | v20.83,40 20.83,39.5 | v26.83,38.5 26.83,38 | v30.33,37.5 30.33,37 | v8.33,58.5 8.08,58.62 | v21.83,60.5 22.33,60.5 | v47.83,75.5 47.83,76 | v48.33,94 48.83,94 | v45.33,101 45.33,100.5 | v27.83,103 27.83,103.5 | v33.83,6.38 33.83,6.75 | v30.95,28 30.95,28.12 31.08,28.25 | v30.83,11.5 30.83,11.25 | v29.2,50.75 28.95,50.75 | v41.58,60.62 41.83,60.62 | v47.45,59.5 47.45,59.75 | v40.08,92.75 40.33,92.75 | v10.33,58.5 9.96,58.5
  other vias: 22.33,85 30.83,91.5 37.58,50.25 43.83,89.5 45.58,77.88 3.21,68.75 3.08,65.62 2.46,79.62 2.83,82.88 12.21,93.5 11.71,104.5 21.45,101.38 22.33,95.38 40.95,104.88 57.7,104.88 57.58,93.75 2.58,23.5 2.58,17.88 2.08,3.62 9.08,2.38 9.71,19.12 18.08,17.25 19.83,11.75 21.45,7 25.45,13 24.95,21.5 41.83,17.25 45.2,19.25 33.7,33.12 35.2,35.12 14.33,31 19.7,30.12 15.46,36.12 22.2,32.25 21.33,33.88 46.83,14 41.08,31.25 54.45,41.5 48.33,44.5 52.58,49.62 50.95,51.75 19.83,47.88 16.2,48.38 23.08,45.62 51.08,63.88 52.45,67 54.2,75.38 55.83,75.88 49.95,78.75 50.45,80.75 45.83,4.75 52.83,2.12 58.2,8.38 37.2,1 24.2,1.25 20.45,53.38 21.95,52.38 22.08,57.12 24.7,56.88 30.2,57 31.45,56 6.96,53.12 4.71,57.5 8.33,67.62 5.58,74.88 7.46,88
  pour Bottom: -1.17,109.22 -1.17,-2.54 62.33,-2.54 62.33,109.22
  pour Top: 79.58,112.62 69.95,7.62 68.33,-2.5 62.95,-3.5 57.83,-3.75 0.08,-3.75 -5.29,1.62 -5.29,107.75 46.95,114.88
KNOB_IN1
  Top 0.203: R23.2 17.83,45.5 18.33,46 19.79,46 R68.P$2
KNOB_IN2  (via drill 0.3)
  Top 0.203: R69.P$2 21.69,24.14 v19.33,26.5 | v16.33,26.5 13.33,29.5 R27.2
  Bottom 0.203: v19.33,26.5 v16.33,26.5
KNOB_INTENSITY
  Top 0.203: R30.2 15.51,3.17 17.83,5.5 19.65,5.5 R17.P$2
KNOB_TEMPO  (via drill 0.3)
  Top 0.203: U1.10 37.83,46.38 | 37.83,46.38 37.83,47.12 | 37.83,46.38 38.08,46.38 v38.2,46.25 | R70.P$2 21.44,92.36 20.08,91 11.33,91 9.21,88.88 9.21,65.75 8.71,65.25 8.71,62.75 6.71,60.75 6.71,58.25 7.21,57.75 10.46,57.75 11.21,57 15.71,57 22.02,50.69 | 22.02,50.69 22.08,50.62 | v39.58,44.88 39.58,44.5 38.83,43.75 37.33,43.75 37.08,43.5 34.7,43.5 v34.08,42.88 34.08,42.75 | v30.83,46.88 30.7,46.75 25.33,46.75 v25.08,47 | v22.45,50.38 22.2,50.38 21.95,50.62 22.02,50.69
  Bottom 0.203: v38.2,46.25 v39.58,44.88 | v30.83,46.88 33.7,46.88 34.08,46.5 v34.08,42.88 | v25.08,47 22.45,49.62 v22.45,50.38
LATCH  (via drill 0.3)
  Top 0.203: U5.12 25.58,84.75 26.08,85.25 26.08,86.88 | 26.08,86.88 26.08,90.38 v25.83,90.62 | v27.2,91 27.2,91.25 27.7,91.75 U4.12 | U3.12 44.08,92.75 v43.2,93.62 | U1.19 38.82,54.13 38.08,54.88 30.2,54.88 v29.33,55.75 | v41.83,94.12 32.45,94.12 31.95,94.62 30.95,94.62 30.45,95.12 30.45,96 v31.33,96.88 | v27.45,83.88 28.33,83 28.33,80.38 26.95,79 26.95,70 29.33,67.62 29.33,66.5 26.95,64.12 26.95,61.5 26.08,60.62 26.08,59.38 25.58,58.88 25.58,57.38 v26.2,56.75 | v25.58,86.88 26.08,86.88
  Bottom 0.203: v43.2,93.62 42.7,94.12 v41.83,94.12 | 26.83,91.38 26.45,91.75 26.45,95 28.95,97.5 30.7,97.5 v31.33,96.88 | 26.83,91.38 v27.2,91 | v25.83,90.62 26.08,90.62 26.83,91.38 | v29.33,55.75 27.2,55.75 v26.2,56.75 | v27.45,83.88 26.7,84.62 26.7,85.75 v25.58,86.88
N$1
  Top 0.203: R32.2 37.57,75.14 36.45,76.25 34.83,76.25 34.33,75.75 31.33,75.75 30.45,76.62 30.45,85.62 31.33,86.5 31.83,86.5 32.33,87 32.33,88.25 31.7,88.88 31.33,88.88 31.08,89.12 U4.1
N$2
  Top 0.203: IC3.6 32.87,14.3 R6.1 32.33,14.01 R4.2
N$3
  Top 0.203: J2.TIP@3 6.75,55 12.83,55 13.83,54 R16.2
N$4
  Top 0.203: IC4.9 41.63,41.04 R12.2 C15.1 R15.1 38.09,40.5 25.58,40.5 23.95,42.12 18.2,42.12 15.83,44.5 14.33,44.5 14.07,44.76 R23.1 13.83,45.74 R16.1
N$5
  Top 0.203: U7.8 31.21,35.38 R9.2
N$6
  Top 0.203: J3.TIP@3 10.55,34.98 R1.2
N$7
  Top 0.203: U7.6 28.67,35.42 R7.2
N$8  (via drill 0.3)
  Top 0.203: C1.1 R2.2 52.03,35.96 IC4.2 49.39,36 v48.08,36 | R1.1 13.33,36.24 R27.1 13.34,34.75 16.83,34.75 20.2,31.38 v20.58,31.38 | v45.83,36 45.83,33.88 44.95,33 R3.1 39.59,32.51 39.08,32 v30.7,32 | v27.83,32.75 24.95,32.75 22.45,30.25 v21.7,30.25
  Bottom 0.203: v45.83,36 v48.08,36 | v30.7,32 30.08,32 29.33,32.75 v27.83,32.75 | v21.7,30.25 v20.58,31.38
N$9  (via drill 0.3)
  Top 0.203: IC3.13 27.79,24.2 C2.1 R5.2 29.09,28.26 v29.33,28.5 | v29.33,30.5 29.33,31.74 R9.1
  Bottom 0.203: v29.33,28.5 v29.33,30.5
N$10
  Top 0.203: R8.2 29.33,13.76 C3.1 27.79,15.3 IC3.2 27.83,17.44 27.83,20 27.58,20.25 26.58,20.25 25.83,21 25.83,27 28.33,29.5 28.33,32 28.83,32.5 R7.1
N$12
  Top 0.203: R13.1 53.83,88.27 D42.-
N$13  (via drill 0.3)
  Top 0.381: D1.1 v22.83,73.5
  Bottom 0.381: U$1.10 22.83,72.9 | 22.83,72.9 U$1.9 | v22.83,73.5 22.83,72.9
N$14
  Top 0.203: R24.2 36.7,17.4 IC3.7 34.14,14.05 R6.2
N$15
  Top 0.203: Q1.B 29.93,102.64 R18.2
N$16
  Top 0.203: R18.1 32.73,103.5 37.83,103.5 37.77,103.56 J5.TIP@3
N$17
  Top 0.203: IC3.9 32.87,28.2 R52.1 32.57,29.98 R53.2
N$18
  Top 0.203: IC3.1 26.52,15.05 C3.2 27.57,13.26 28.33,12.5 28.33,9.74 R8.1 R4.1
N$19
  Top 0.203: R33.2 40.74,76.09 38.33,78.5 35.95,78.5 34.95,79.5 34.95,85.5 33.95,86.5 33.95,88.32 U4.2
N$20
  Top 0.203: J13.TIP@3 38.46,28.63 R25.1
N$21
  Top 0.203: J12.TIP@3 40.1,15.52 R24.1
N$23
  Top 0.203: R10.1 55.86,31.24 D40.-
N$24
  Top 0.203: IC3.14 26.52,24.45 C2.2 R5.1 27.57,27.74 29.83,30 R53.1
N$25
  Top 0.203: Q3.B 51.14,30.55 R21.2
N$26
  Top 0.203: U4.3 32.97,90.74 33.08,90.62 33.08,90 34.45,88.62 34.45,86.75 35.58,85.62 35.58,79.75 36.33,79 38.7,79 R34.2
N$27
  Top 0.203: R35.2 35.07,88.76 33.58,90.25 33.58,91.12 33.45,91.25 U4.4
N$28
  Top 0.203: D28.+ 13.44,67.94 R62.1
N$29
  Top 0.203: R19.1 Q3.C 47.73,28.6 52.2,24.12 52.2,19.66 J7.TIP@3
N$30
  Top 0.203: R36.2 36.69,89.26 36.2,89.75 34.83,89.75 34.08,90.5 34.08,91.5 33.83,91.75 U4.5
N$31
  Top 0.203: R54.2 39.47,84.98 38.83,85.62 38.83,89.5 38.08,90.25 35.08,90.25 34.58,90.75 34.58,91.75 34.08,92.25 32.04,92.25 U4.6
N$32
  Top 0.203: D29.+ R61.1
N$33
  Top 0.203: R14.2 13.44,11.39 10.33,14.5 6.61,14.5 J1.TIP@3
N$34  (via drill 0.3)
  Top 0.203: R30.1 13.44,3.3 R14.1 13.92,5.59 14.83,6.5 14.83,23.5 20.58,29.25 20.58,30.38 21.45,31.25 22.58,31.25 26.2,34.88 v27.08,34.88 | v32.58,34.88 34.2,36.5 38.09,36.5 R28.1 C16.1 R22.2 41.63,35.96 IC4.13
  Bottom 0.203: v32.58,34.88 v27.08,34.88
N$35
  Top 0.203: U4.7 34.82,92.75 R55.2
N$36
  Top 0.203: R31.2 31.19,75.14 29.95,76.38 29.95,85.5 28.33,87.12 28.33,88.25 29.58,89.5 29.58,90.2 U4.15
N$37
  Top 0.203: R56.2 10.84,89 12.33,90.5 22.58,90.5 23.08,90 23.08,86.69 U5.15
N$38
  Top 0.203: R57.2 13.34,89.01 14.33,90 17.95,90 21.08,86.88 21.9,86.88 U5.1
N$39
  Top 0.203: U5.2 19.46,86.25 17.33,88.38 17.33,88.86 R58.2
N$40
  Top 0.203: U5.3 19.32,85.76 18.08,87 R59.2
N$41
  Top 0.203: R61.2 11.53,75.33 15.21,79 16.95,79 17.83,79.88 17.83,83.75 19.33,85.25 U5.4
N$42
  Top 0.203: U5.5 19.45,84.75 18.33,83.62 18.33,79.75 17.08,78.5 15.96,78.5 13.46,76 13.46,75.08 R62.2
N$43
  Top 0.203: J4.TIP@3 10.95,94.54 R67.1
N$44
  Top 0.203: R49.1 D41.-
N$45
  Top 0.203: R48.1 55.77,58 D44.-
N$48
  Top 0.203: R63.2 15.34,75.89 15.83,76.38 17.33,76.38 18.83,77.88 18.83,83.5 19.58,84.25 21.12,84.25 U5.6
N$49
  Top 0.203: R64.2 17.24,75.54 19.33,77.62 19.33,83.25 19.83,83.75 U5.7
N$57
  Top 0.203: Q4.B 34.2,3.75 46.95,16.5 R38.2
N$58
  Top 0.203: R37.1 Q4.C 31.64,3.94 32.95,2.62 49.77,2.62 J8.TIP@3
N$60
  Top 0.203: Q5.B 43.83,101.92 R40.2
N$61
  Top 0.203: Q5.C 44.41,104.5 45.83,104.5 46.33,104 46.33,103.5 | 46.33,103.5 46.33,99 45.33,98 R39.1 | J6.TIP@3 52.11,103.5 46.33,103.5
N$63
  Top 0.203: R42.2 51.99,92.6 Q6.B
N$64  (via drill 0.3)
  Top 0.381: D2.2 24.33,65 v22.83,63.5
  Bottom 0.381: U$1.1 22.83,62.74 | 22.83,62.74 U$1.2 | U$1.2 26.07,62.74 26.33,63 25.63,63 U$1.2 | v22.83,63.5 22.83,62.74
N$65  (via drill 0.3)
  Top 0.203: Q6.C 49.33,89.26 R41.1 50.33,88.26 50.33,87 49.33,86 49.33,84.75 52.95,81.12 v53.33,81.12 | J9.TIP@3 52.17,79.59 v52.2,79.62
  Bottom 0.203: v52.2,79.62 52.2,80 v53.33,81.12
N$66
  Top 0.203: R67.2 6.15,91.27 Q2.B
N$68
  Top 0.203: Q7.B 47.88,74 R44.2
N$69
  Top 0.203: J10.TIP@3 52.13,61.5 R43.1 46.09,70.99 44.7,72.38 44.7,73.97 Q7.C
N$71
  Top 0.203: Q8.B 48.12,57.55 R46.2
N$72
  Top 0.203: J11.TIP@3 52.11,46.35 R45.1 45.81,55.14 44.2,56.75 44.2,58.48 Q8.C
N$73
  Top 0.203: D27.+ 11.59,80.01 12.71,81.12 R57.1
N$74
  Top 0.203: R56.1 10.84,85.78 D26.+
N$75
  Top 0.203: D25.+ 14.33,82.29 14.33,87.5 15.73,88.9 R58.1
N$76
  Top 0.203: R59.1 16.61,86.23 D24.+
N$77
  Top 0.203: D30.+ 15.34,67.31 R63.1
N$78
  Top 0.203: D31.+ 17.24,71.75 R64.1
N$79
  Top 0.203: D32.+ 40.74,67.31 R33.1
N$80
  Top 0.203: D33.+ 37.24,66.04 38.2,67 38.2,72.99 R32.1
N$81
  Top 0.203: D34.+ 36.93,72.26 R31.1
N$82
  Top 0.203: D35.+ 42.64,71.75 R34.1
N$83
  Top 0.203: D36.+ 40.49,85.09 39.45,86.12 39.45,89.64 R55.1
N$84
  Top 0.203: R54.1 41.8,80.22 D37.+
N$85
  Top 0.203: D38.+ 36.93,85.64 R35.1
N$86
  Top 0.203: D39.+ 36.93,80.1 38.33,81.5 38.33,86.74 R36.1
N$94
  Top 0.203: IC3.8 34.14,28.45 R52.2 34.09,30.52 R25.2
N$96
  Top 0.203: J4.SWITCH@3 3.44,95.36 0.83,92.75 0.83,75.58 R11.1
N$97
  Top 0.203: IC4.5 50.98,39.77 51.83,40.62 51.83,41.62 51.2,42.25 49.49,42.25 IC4.7
OUT_ACCENT  (via drill 0.3)
  Top 0.203: R21.1 R10.2 56.72,32.76 57.58,33.62 57.58,37.25 v56.08,38.75 | v56.08,40.5 57.45,41.88 57.45,56.12 56.95,56.62 56.95,58.75 57.58,59.38 57.58,71.25 56.95,71.88 56.95,75.88 49.08,83.75 46.95,83.75 43.58,87.13 U3.4
  Bottom 0.203: v56.08,38.75 v56.08,40.5
OUT_BEAT
  Top 0.203: R47.2 R44.1 50.59,74.36 49.2,75.75 49.2,77 45.45,80.75 45.45,84 42.58,86.88 U3.2
OUT_CLOCK
  Top 0.203: U3.15 42.59,93.99 R40.1
OUT_GATE  (via drill 0.3)
  Top 0.203: R49.2 R38.1 51.95,16.5 53.2,17.75 55.08,17.75 57.95,20.62 57.95,29.88 57.45,30.38 57.45,31.75 58.08,32.38 58.08,38.5 v57.83,38.75 | v57.83,40.38 57.83,40.5 58.08,40.75 58.08,56.25 57.45,56.88 57.45,58.5 58.08,59.12 58.08,71.38 57.45,72 57.45,76 49.2,84.25 47.08,84.25 44.08,87.25 U3.5
  Bottom 0.203: v57.83,38.75 v57.83,40.38
OUT_LOOP
  Top 0.203: R48.2 R46.1 51.95,58 53.45,59.5 54.58,59.5 55.2,60.12 55.2,63 54.08,64.12 54.08,68 55.2,69.12 55.2,71.25 53.33,73.12 53.33,74.75 52.95,75.12 50.58,75.12 49.7,76 49.7,77.12 45.95,80.88 45.95,84.12 43.07,87.01 U3.3
OUT_TICK  (via drill 0.3)
  Top 0.203: R42.1 R13.2 51.45,87.89 v51.45,87.5 | U3.1 42.13,89.05 41.83,88.75 v41.83,87.12
  Bottom 0.203: v41.83,87.12 45.2,87.12 45.83,87.75 51.2,87.75 v51.45,87.5
PTA6  (via drill 0.3)
  Top 0.203: U1.8 36.82,47.11 36.7,47 36.08,47 v35.45,46.38
  Bottom 0.203: v35.45,46.38 35.45,48.12 TP1.TP
REF_-5V  (via drill 0.3)
  Top 0.203: R3.2 38.33,33.26 R28.2 37.72,34.74 v36.7,35.75 | R26.2 13.97,60.35 U2.2 12,60.17 C6.2 8.21,60.74 v8.21,61 | R15.2 38.09,42.26 36.83,41 36.7,41 | 36.7,41 25.83,41 24.2,42.62 18.45,42.62 16.95,44.12 v16.95,44.75 | v16.95,46.5 16.7,46.5 16.08,47.12 v14.58,47.12 | v36.7,37.12 v36.7,39.38 | v36.7,41.5 36.7,41 | v4.46,60.88 3.83,60.25 3.83,54.88 7.46,51.25 v7.46,50.25 | v10.96,47.12 v13.08,47.12
  Bottom 0.203: v16.95,44.75 v16.95,46.5 | v36.7,35.75 v36.7,37.12 | v36.7,39.38 v36.7,41.5 | v8.21,61 8.08,60.88 v4.46,60.88 | v7.46,50.25 7.46,50 10.33,47.12 v10.96,47.12 | v13.08,47.12 v14.58,47.12
RESET_PATTERN  (via drill 0.3)
  Top 0.203: Q1.C 29.33,99.64 R20.1 29.95,97.25 v30.95,98.25 | U1.13 40.7,49.01 v41.08,48.62 | v42.7,51.75 42.7,54.12 42.14,54.69 | 42.14,54.69 42.08,54.75 | v44.33,83 44.08,82.75 44.08,76.25 45.83,74.5 45.83,73.5 45.2,72.88 45.2,72.5 45.95,71.75 v46.2,71.75 | v43.33,84 43.33,85.5 42.33,86.5 41.58,86.5 39.95,88.12 39.95,89.38 v40.08,89.5 | v39.08,92.38 36.58,92.38 35.7,93.25 v35.7,93.5 | v45.33,70.88 45.08,70.62 45.08,64.38 v45.33,64.12 | v43.83,62.62 43.58,62.38 43.58,61.25 42.45,60.12 42.45,55 42.14,54.69
  Bottom 0.203: v41.08,48.62 41.08,50.12 v42.7,51.75 | v43.33,84 v44.33,83 | v40.08,89.5 40.08,91.38 v39.08,92.38 | v30.95,98.25 v35.7,93.5 | v45.33,70.88 v46.2,71.75 | v43.83,62.62 v45.33,64.12
SCL  (via drill 0.3)
  Top 0.203: R50.2 35.66,58.69 U6.1 36.2,58.14 36.2,57 36.33,56.88 38.2,56.88 39.33,55.75 v39.33,54.88 | U1.17 40.84,51.01 40.95,51.12 40.95,54.62 v40.7,54.88
  Bottom 0.203: v40.7,54.88 v39.33,54.88
SDA
  Top 0.203: U6.3 38.22,58.2 R51.2 | 39.78,56.65 R51.2 | U1.18 39.78,51.7 39.95,51.88 39.95,56.47 R51.2
SHIFTER1TO2
  Top 0.203: U4.14 28.19,90.74 27.08,89.62 27.08,84.5 24.83,82.25 23.08,82.25 22.58,82.75 U5.9
SHIFTER2TO3  (via drill 0.3)
  Top 0.203: U3.14 43.07,91.99 v43.2,92 | v41.95,92 41.2,92 40.95,91.75 40.95,91.5 40.7,91.25 39.33,91.25 38.7,91.88 36.45,91.88 35.08,93.25 32.45,93.25 31.58,94.12 30.83,94.12 30.58,93.88 U4.9
  Bottom 0.203: v43.2,92 v41.95,92
SHIFTERS  (via drill 0.3)
  Top 0.203: U5.14 24.44,85.76 v24.83,85.38 | v26.08,82.38 26.55,82.38 26.55,69.82 28.07,68.29 v28.07,67.72 | v33.41,52.2 34.55,51.05 35.31,51.05 U1.2
  Bottom 0.203: v24.83,85.38 26.08,84.12 v26.08,82.38 | v33.41,52.2 33.41,54.72 33,55.12 32.95,55.12 32.95,56.5 33.45,57 33.45,58.33 33.42,58.48 33.42,60.21 28.07,65.44 v28.07,67.72
SWD_CLK  (via drill 0.3)
  Top 0.203: U1.22 37.33,53.25 36.7,53.88 31.7,53.88 v31.45,53.62 | v20.58,56.62 21.83,55.38 v24.7,55.38
  Bottom 0.203: v31.45,53.62 30.83,54.25 25.83,54.25 v24.7,55.38 | SWD1.4 17.95,56 18.58,56.62 v20.58,56.62
SWD_DIO  (via drill 0.3)
  Top 0.203: v30.7,52.75 31.33,52.75 31.45,52.88 33.58,52.88 33.95,52.5 34.7,52.5 35.08,52.88 35.91,52.88 U1.24 | v24.08,54.62 23.58,54.12 20.2,54.12 18.95,55.38 v18.45,55.38
  Bottom 0.203: v30.7,52.75 29.7,53.75 25.08,53.75 24.2,54.62 v24.08,54.62 | v18.45,55.38 17.83,54.75 17.7,54.75 17.68,54.72 SWD1.2

### Text on the board
tNames: J4 | R70 | J5 | J6 | J9 | J10 | J2 | R68 | J11 | U1 | IC1 | J3 | R69 | J13 | J7 | J1 | R17 | J12 | J8
bNames: J14